# EAGLE design SBM20_counter (EAGLE 9.6.2)
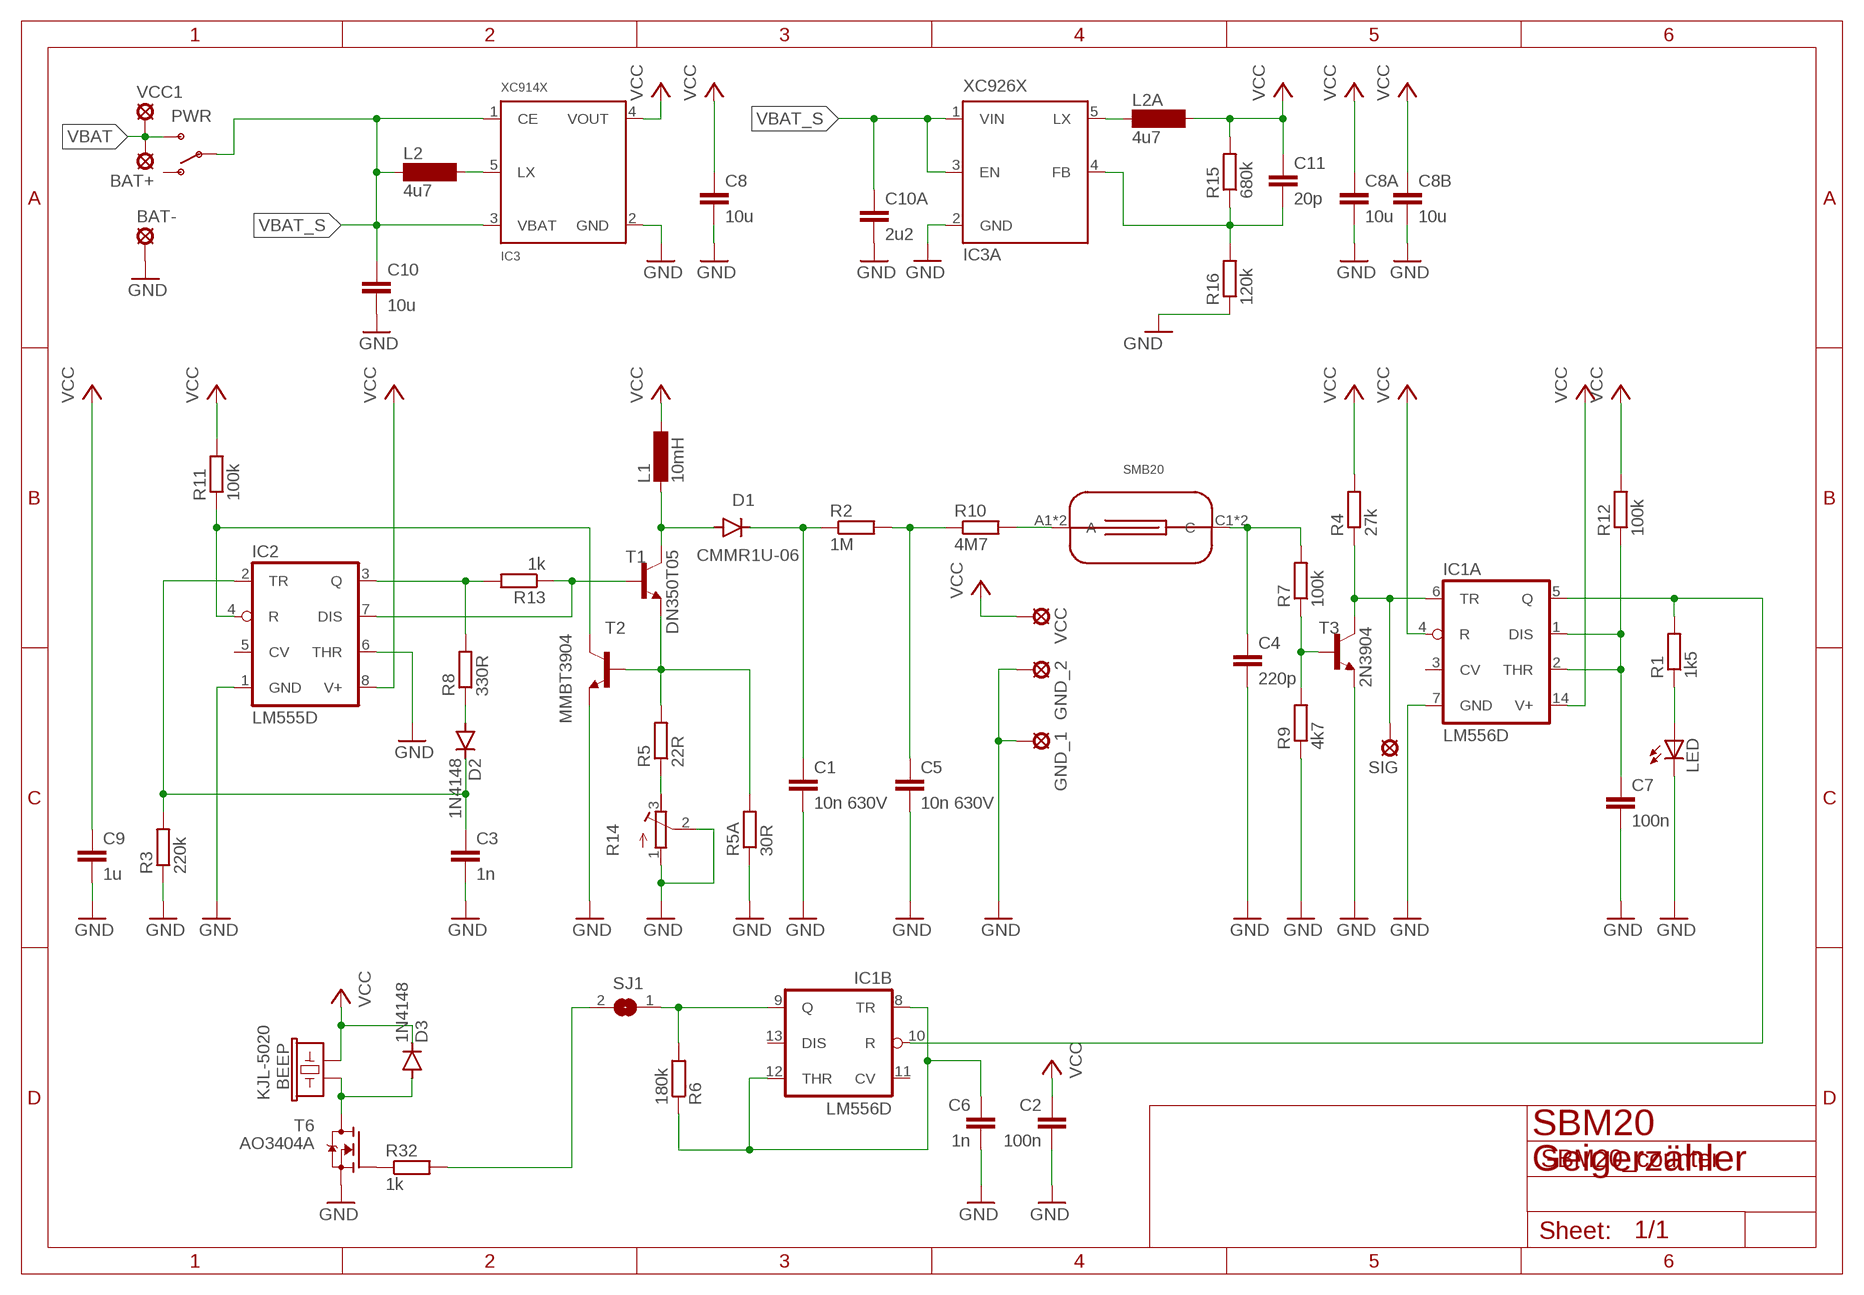
[diagram p0: schematic, sheet 1]

## Parts
BAT+  LSP10_CAST  [CASTEL_1]
BAT-  LSP10_CAST  [CASTEL_1]
BEEP  KJL-5020  BUZZER-5020  [KLJ-5020]
C1  10n 630V  C-EUC1206  [C1206]
C2  100n  C-EUC0603  [C0603]
C3  1n  C-EUC0603  [C0603]
C4  220p  C-EUC0603  [C0603]
C5  10n 630V  C-EUC1206  [C1206]
C6  1n  C-EUC0603  [C0603]
C7  100n  C-EUC0603  [C0603]
C8  10u  C-EUC1206  [C1206]
C8A  10u  C-EUC1206  [C1206]
C8B  10u  C-EUC1206  [C1206]
C9  1u  C-EUC1206  [C1206]
C10  10u  C-EUC1206  [C1206]
C10A  2u2  C-EUC1206  [C1206]
C11  20p  C-EUC0603  [C0603]
D1  CMMR1U-06  DIODE-DO-214AC  [DO-214AC]
D2  1N4148  DIODE-SOD123  [SOD123]
D3  1N4148  DIODE-SOD123  [SOD123]
GND_1  LSP10_CAST  [CASTEL_1]
GND_2  LSP10_CAST  [CASTEL_1]
IC1  LM556D  [SO14]
IC2  LM555D  [SO08]
IC3  XC914X  [SOT23-5]
IC3A  XC926X  [SOT23-5]
L1  10mH  L-EUL8065  [L8065]
L2  4u7  L  [L5050]
L2A  4u7  L  [L5050]
LED  LEDCHIPLED_1206  [CHIPLED_1206]
PWR  SWITCH-SPDT-SMD-A  [SWITCH-SPST-SMD-A]
R1  1k5  R-EU_R0603  [R0603]
R2  1M  R-EU_R1206  [R1206]
R3  220k  R-EU_R0603  [R0603]
R4  27k  R-EU_R0603  [R0603]
R5  22R  R-EU_R0603  [R0603]
R5A  30R  R-EU_R0603  [R0603]
R6  180k  R-EU_R0603  [R0603]
R7  100k  R-EU_R0603  [R0603]
R8  330R  R-EU_R0603  [R0603]
R9  4k7  R-EU_R0603  [R0603]
R10  4M7  R-EU_R1206  [R1206]
R11  100k  R-EU_R0603  [R0603]
R12  100k  R-EU_R0603  [R0603]
R13  1k  R-EU_R0603  [R0603]
R14  R-TRIMM3224J  [RTRIM3224J]
R15  680k  R-EU_R0603  [R0603]
R16  120k  R-EU_R0603  [R0603]
R32  1k  R-EU_R0603  [R0603]
SIG  LSP10_CAST  [CASTEL_1]
SJ1  SJ  [SJ]
T1  DN350T05  MMBT3904LT1-NPN-SOT23-BEC  [SOT23-BEC]
T2  MMBT3904  MMBT3904LT1-NPN-SOT23-BEC  [SOT23-BEC]
T3  2N3904  MMBT3904LT1-NPN-SOT23-BEC  [SOT23-BEC]
T6  AO3404A  N-MOSFET-SOT23-3  [SOT23]
U$1  SMB20  STS5  [STS5]
VCC  LSP10_CAST  [CASTEL_1]
VCC1  LSP10_CAST  [CASTEL_1]

## Nets
GND: BAT-.C(MP) BAT-.V(MP) C1.2 C2.2 C3.2 C4.2 C5.2 C6.2 C7.2 C8.2 C8A.2 C8B.2 C9.2 C10.2 C10A.2 GND_1.C(MP) GND_1.V(MP) GND_2.C(MP) GND_2.V(MP) IC1.7(A:GND) IC2.1(GND) IC2.6(THR) IC3.2(GND) IC3A.2(GND) LED.C R3.1 R5A.1 R9.1 R14.1(A) R14.2(S) R16.1 T2.E T3.E T6.2(S)
N$1: R5.2 R5A.2 T1.E T2.B
N$2: IC2.3(Q) R8.2 R13.2
N$3: C3.1 D2.C IC2.2(TR) R3.2
N$4: IC2.4(R) R11.1 T2.C
N$5: IC2.7(DIS) R13.1 T1.B
N$6: D2.A R8.1
N$7: R5.1 R14.3(E)
N$8: D1.A L1.2 T1.C
N$9: C1.1 D1.C R2.1
N$10: C5.1 R2.2 R10.1
N$11: R10.2 U$1.A1(A) U$1.A2(A)
N$12: C4.1 R7.2 U$1.C1(C) U$1.C2(C)
N$13: R7.1 R9.2 T3.B
N$14: IC1.6(A:TR) R4.1 SIG.C(MP) SIG.V(MP) T3.C
N$15: IC1.5(A:Q) IC1.10(B:R) R1.2
N$16: C7.1 IC1.1(A:DIS) IC1.2(A:THR) R12.1
N$17: IC1.9(B:Q) R6.2 SJ1.1
N$18: LED.A R1.1
N$19: R32.2 SJ1.2
N$20: IC3A.5(LX) L2A.1
N$21: C6.1 IC1.8(B:TR) IC1.12(B:THR) R6.1
N$23: IC3.5(LX) L2.2
N$24: C11.2 IC3A.4(FB) R15.1 R16.2
N$29: R32.1 T6.1(G)
N$30: BEEP.- D3.A T6.3(D)
VBAT: BAT+.C(MP) BAT+.V(MP) PWR.3(S) VCC1.C(MP) VCC1.V(MP)
VBAT_S: C10.1 C10A.1 IC3.1(CE) IC3.3(VBAT) IC3A.1(VIN) IC3A.3(EN) L2.1 PWR.2(P)
VCC: BEEP.+ C2.1 C8.1 C8A.1 C8B.1 C9.1 C11.1 D3.C IC1.4(A:R) IC1.14(A:V+) IC2.8(V+) IC3.4(VOUT) L1.1 L2A.2 R4.2 R11.2 R12.2 R15.2 VCC.C(MP) VCC.V(MP)
Unconnected: IC1.3(A:CV) IC1.11(B:CV) IC1.13(B:DIS) IC2.5(CV) PWR.1(O)

## Notes on the sheet
- SBM20
- Geigerzähler

## Library data of the parts
BAT+ BAT- GND_1 GND_2 SIG VCC VCC1 = solpad:LSP10: SOLDER PAD drill 1.0 mm, distributor Buerklin, 12H555
BEEP = SparkFun-Electromechanical:BUZZER: Buzzer Small round buzzers that operate around the audible 2kHz range. You can use these as speakers to create simple music or user interfaces. Variant Overview: PTH - Mini Speaker - PC Mount 12mm 2.048kHz <https://www.sparkfun.com/products/7950> PTH_KIT - Mini Speaker - PC Mount 12mm 2.048kHz <https://www.sparkfun.com/products/7950> KIT simplifies soldering by adding stop mask to one side of the pads. PTH_NO_SILK - Mini Speaker - PC Mount 12mm 2.048kHz <https://www.sparkfun.com/products/7950> No silkscreen indicator of buzzer outline. PTH_KIT_NO_SILK - Mini Speaker - PC Mount 12mm 2.048kHz <https://www.sparkfun.com/products/7950> KIT package w/o silkscreen SMD - Buzzer Audio Magnetic (CCV-084B16) SMD buzzer used on, e.g. the LilyPad Buzzer <https://www.sparkfun.com/products/8463> and RFID USB Reader <https://www.sparkfun.com/products/9963>. SMD_KIT - Buzzer Audio Magnetic (CCV-084B16) SMD Buzzer with elongated pins to make soldering easier. Used on the SparkFun Simon Says - Surface Mount Soldering Kit <https://www.sparkfun.com/products/10935>.; LCSC: C556937
C1-C8 C8A C8B C9 C10 C10A C11 = rcl:C-EU: CAPACITOR, European symbol; SPICEPREFIX: C
D1-D3 = diode:DIODE-: DIODE
IC1 = linear:*556: Dual TIMER
IC2 = linear:*555: TIMER
IC3 = torex:XC914X: Step-Up Converter; DIGIKEY: 893-1373-1-ND
IC3A = torex:XC926X: Step-Down Converter; DIGIKEY: 893-1330-1-ND
L1 = rcl:L-EU: INDUCTOR, European symbol
L2 L2A = misc:L; DIGIKEY: 490-7779-1-ND
LED = led:LED: LED OSRAM: - CHIPLED LG R971, LG N971, LY N971, LG Q971, LY Q971, LO R971, LY R971 LH N974, LH R974 LS Q976, LO Q976, LY Q976 LO Q996 - Hyper CHIPLED LW Q18S LB Q993, LB Q99A, LB R99A - SideLED LS A670, LO A670, LY A670, LG A670, LP A670 LB A673, LV A673, LT A673, LW A673 LH A674 LY A675 LS A676, LA A676, LO A676, LY A676, LW A676 LS A679, LY A679, LG A679 - Hyper Micro SIDELED® LS Y876, LA Y876, LO Y876, LY Y876 LT Y87S - SmartLED LW L88C, LW L88S LB L89C, LB L89S, LG L890 LS L89K, LO L89K, LY L89K LS L896, LA L896, LO L896, LY L896 - TOPLED LS T670, LO T670, LY T670, LG T670, LP T670 LSG T670, LSP T670, LSY T670, LOP T670, LYG T670 LG T671, LOG T671, LSG T671 LB T673, LV T673, LT T673, LW T673 LH T674 LS T676, LA T676, LO T676, LY T676, LB T676, LH T676, LSB T676, LW T676 LB T67C, LV T67C, LT T67C, LS T67K, LO T67K, LY T67K, LW E67C LS E67B, LA E67B, LO E67B, LY E67B, LB E67C, LV E67C, LT E67C LW T67C LS T679, LY T679, LG T679 LS T770, LO T770, LY T770, LG T770, LP T770 LB T773, LV T773, LT T773, LW T773 LH T774 LS E675, LA E675, LY E675, LS T675 LS T776, LA T776, LO T776, LY T776, LB T776 LHGB T686 LT T68C, LB T68C - Hyper Mini TOPLED® LB M676 - Mini TOPLED Santana® LG M470 LS M47K, LO M47K, LY M47K Source: http://www.osram.convergy.de LUXEON: - LUMILED® LXK2-PW12-R00, LXK2-PW12-S00, LXK2-PW14-U00, LXK2-PW14-V00 LXK2-PM12-R00, LXK2-PM12-S00, LXK2-PM14-U00 LXK2-PE12-Q00, LXK2-PE12-R00, LXK2-PE12-S00, LXK2-PE14-T00, LXK2-PE14-U00 LXK2-PB12-K00, LXK2-PB12-L00, LXK2-PB12-M00, LXK2-PB14-N00, LXK2-PB14-P00, LXK2-PB14-Q00 LXK2-PR12-L00, LXK2-PR12-M00, LXK2-PR14-Q00, LXK2-PR14-R00 LXK2-PD12-Q00, LXK2-PD12-R00, LXK2-PD12-S00 LXK2-PH12-R00, LXK2-PH12-S00 LXK2-PL12-P00, LXK2-PL12-Q00, LXK2-PL12-R00 Source: www.luxeon.com KINGBRIGHT: KA-3528ASYC Source: www.kingbright.com
PWR = SparkFun-Electromechanical:SWITCH-SPDT: SPDT Switch Simple slide switch, Spark Fun Electronics SKU : COM-00102 DPDT SMT slide switch, AYZ0202, SWCH-08179; LCSC: C319019; PROD_ID: SWCH-10651
R1-R5 R5A R6-R13 R15 R16 = rcl:R-EU_: RESISTOR, European symbol; SPICEPREFIX: R
R14 = rcl:R-TRIMM: Trimm resistor; SPICEMODEL: X; SPICEPREFIXL: POT
R32 = rcl:R-EU_: RESISTOR, European symbol; LCSC: C11702; SPICEPREFIX: R
SJ1 = jumper:SJ: SMD solder JUMPER
T1-T3 = transistor:*-NPN-: NPN Transistror BF959 corrected 2008.03.06
T6 = transistor-fet:N-MOSFET: N-MOSFET; LCSC: C30010
U$1 = SBT10A:STS5: STS5

## Board
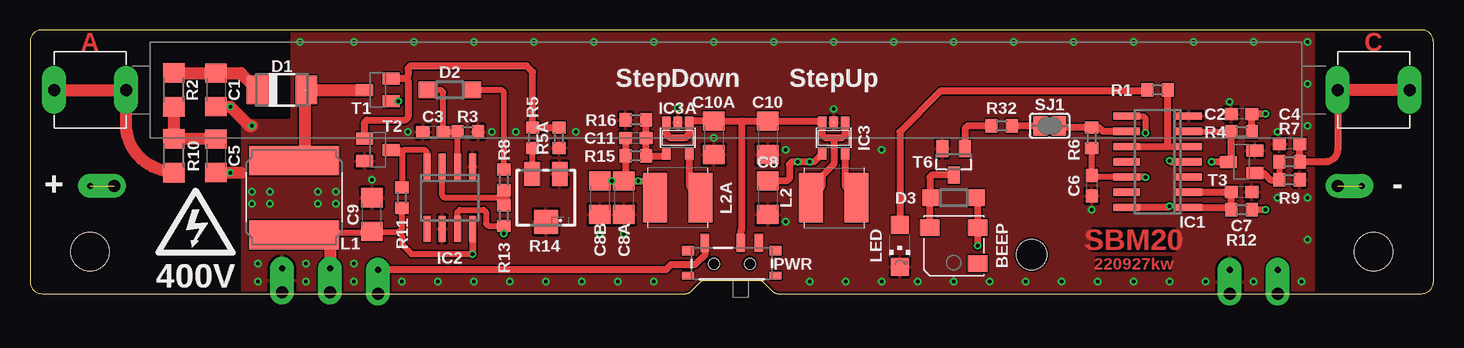
[diagram p1: board, top side]
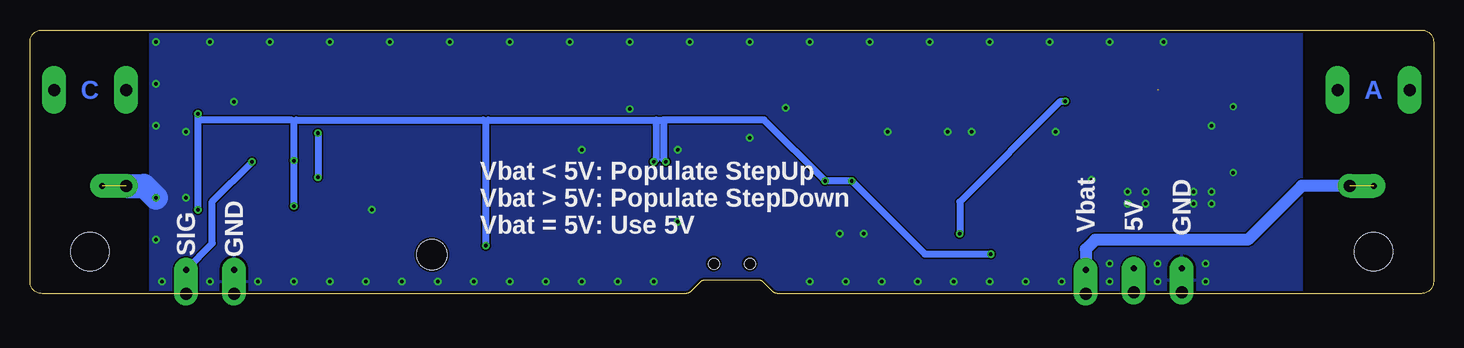
[diagram p2: board, bottom side, seen from below]

Size 117 x 22 mm. Coordinates in mm from the lower left corner, seen from the top.
Outline: 0,21 0,1 arc90 1,0 54.69,0 arc45 55.05,0.15 55.85,0.95 arc-45 56.21,1.1 60.79,1.1 arc-45 61.15,0.95 61.95,0.15 arc45 62.31,0 116,0 arc90 117,1 117,21 arc90 116,22 1,22 arc90 0,21
Copper layers (1*16): Top 0.035mm / dielectric 1.5mm / Bottom 0.035mm
Design rules "JLCPCB_2Layer_1oz": minimum track width 5mil, minimum drill 0.3mm, track to track 5mil, track to pad 5mil, pad to pad 5mil, via to via 5mil, smd to smd 0mil, copper to edge 0.2mm, drill to drill 0.5mm, minimum pad ring 0.2mm, minimum via ring 0.15mm, stop-mask expansion 0.05mm, vias tented up to drill 0.3mm, thermal gap 0.2mm
Holes 3.2 mm at 112,3.5 5,3.5
Holes 2.5 mm at 83.5,3.25

### Footprints (pad centres in the part's own frame; a part is rotated, then mirrored left to right if it is on the bottom)
CASTEL_1 = drill 1 pad 2 offset: C 0,0 | drill 0.5: V 2,0
KLJ-5020 = smd 1.6 x 1.4: + -2,-1.5; - 2,-1.5; S -2,1.5
C1206 = smd 1.6 x 1.8: 1 -1.4,0; 2 1.4,0
C0603 = smd 1.1 x 1: 1 -0.85,0; 2 0.85,0
DO-214AC = smd 1.8 x 2.4: A 2.025,0; C -2.025,0
SOD123 = smd 1.4 x 1.4: A 1.9,0; C -1.9,0
SO14 = smd 0.6 x 2.2: 1 -3.81,-2.6; 2 -2.54,-2.6; 3 -1.27,-2.6; 4 0,-2.6; 5 1.27,-2.6; 6 2.54,-2.6; 7 3.81,-2.6; 8 3.81,2.6; 9 2.54,2.6; 10 1.27,2.6; 11 0,2.6; 12 -1.27,2.6; 13 -2.54,2.6; 14 -3.81,2.6
SO08 = smd 0.6 x 2.2: 1 -1.905,-2.6; 2 -0.635,-2.6; 3 0.635,-2.6; 4 1.905,-2.6; 5 1.905,2.6; 6 0.635,2.6; 7 -0.635,2.6; 8 -1.905,2.6
SOT23-5 = smd 0.69 x 0.99: 1 -0.95,-1.29; 2 0,-1.29; 3 0.95,-1.29; 4 0.95,1.3; 5 -0.95,1.3
L8065 = smd 2.4 x 7.5: 1 3.1,0; 2 -3.1,0
L5050 = smd 2 x 4.1: 1 -1.9,0; 2 1.9,0
CHIPLED_1206 = smd 1.5 x 1.5: A 0,-1.75; C 0,1.75
SWITCH-SPST-SMD-A = smd 0.7 x 1.5: 1 -2.25,-1.75; 2 -0.75,-1.75; 3 2.25,-1.75 | smd 1 x 0.6: GND1 -3.65,1; GND3 3.65,1 | smd 1 x 0.8: GND2 -3.65,-1.1; GND4 3.65,-1.1 | hole 0.9: -1.5,0; 1.5,0
R0603 = smd 1 x 1.1: 1 -0.85,0; 2 0.85,0
R1206 = smd 1.6 x 1.803: 1 -1.422,0; 2 1.422,0
RTRIM3224J = smd 1.3 x 2: 1 -1.15,-2; 3 1.15,-2 | smd 2 x 2: 2 0,2
SJ = smd 1.168 x 1.6: 1 -0.762,0; 2 0.762,0
SOT23-BEC = smd 1 x 1.4: B -0.95,-1.1; C 0,1.1; E 0.95,-1.1
SOT23 = smd 1 x 1.4: 1 -0.95,-1.1; 2 0.95,-1.1; 3 0,1.1
STS5 = drill 1 pad 2 long: A1 -3,0; A2 3,0; C1 104,0; C2 110,0

### Placement (x,y rotation side)
BAT+  7,9 180 top
BAT-  109,9 0 top
BEEP  77,4 180 top
C1  15.5,17 270 top
C2  101,15 180 top
C3  33.6,13.5 180 top
C4  105,12.5 180 top
C5  15.5,11.5 270 top
C6  88.5,9 270 top
C7  101,8.5 0 top
C8  61.5,8 270 top
C8A  49.5,8 270 top
C8B  47.5,8 270 top
C9  28.5,6.6 90 top
C10  61.5,13 270 top
C10A  57,13 270 top
C11  50.5,13 0 top
D1  21,17 0 top
D2  35,17 0 top
D3  77,8 180 top
GND_1  21,0.1 90 top
GND_2  100,0 90 top
IC1  94,11 90 top
IC2  35,8 180 top
IC3  67,13 180 top
IC3A  54,13 180 top
L1  22,8 270 top
L2  67,8 0 top
L2A  54,8 180 top
LED  72.5,4 180 top
PWR  58.5,2.5 180 top
R1  94,17 0 top
R2  12,17 270 top
R3  36.5,13.5 180 top
R4  101,13.5 0 top
R5  41.9,13 90 top
R5A  44.1,13 90 top
R6  88.5,13 90 top
R7  105,11 0 top
R8  39.5,9.5 270 top
R9  105,9.5 180 top
R10  12,11.5 270 top
R11  31,8 270 top
R12  101,7 0 top
R13  39.5,6.5 90 top
R14  43,8 180 top
R15  50.5,11.5 180 top
R16  50.5,14.5 0 top
R32  81,14 0 top
SIG  104,0 90 top
SJ1  85,14 180 top
T1  29,17 90 top
T2  29,12 270 top
T3  101,11 90 top
T6  77,11 180 top
U$1  5,17 0 top
U$2  [HIGHVOLTAGE]  13.8,6 0 top
VCC  25,0.1 90 top
VCC1  29,0 90 top

### Tracks (layer width: path | path; a pad name or v marks a point on that pad's centre or on a via)
GND  (via drill 0.3)  (1 unrouted)
  Top 1: C1.2 v16.7,15.6 18.3,14 v18.5,14 | C5.2 v16.7,10.1 17.6,10.1
  Bottom 2: BAT-.C 107.5,9 v106.5,8
  other vias: 102,21 97,21 23,1 22.5,21 32,21 47,21 38.5,13.5 31.5,13.5 19,1 45.5,13.5 40.5,13.5 98,1 27,1 31,1 34,1 37,1 40,1 43,1 106,1 86,1 87,21 92,21 106.5,14 88.5,7 100,16 104,8 106.5,21 106.5,17.5 106.5,4.5 102,1 18.5,7.5 18.5,8.5 25.5,7.5 95,1 92,1 89,1 25.5,8.5 28.5,9.5 46,1 49,1 52,1 83,1 80,1 77,1 74,1 71,1 68,1 65,1 82,21 77,21 72,21 67,21 62,21 57,21 52,21 42,21 37,21 27,21 57,13 63,12 71,12 47.5,5 49.5,5 54,15.5 67,15.4 19,2.5 23,2.5 20,8.5 20,7.5 24,8.5 24,7.5 104,13.5 27,2.5 63,6
  pour Bottom: 11,0 107,0 107,22 11,22
  pour Top: 17.7,0 107,0 107,22 21.8,22 21.8,14.7 21.6,14.5 17.9,14.5 17.7,14.3
N$1
  Top 0.6: T2.B 27.9,14.3 28.1,14.5 31.3,14.5 31.5,14.7 31.5,17.75 31.3,17.95 | 31.3,17.95 T1.E | 31.3,17.95 31.5,18.15 31.5,18.8 31.7,19 41.4,19 41.9,18.5 R5.2 R5A.2
N$2
  Top 0.5: 39.35,7.5 R13.2 | 39.5,8 34.56,8 34.37,8.2 IC2.3
  Top 1: R8.2 39.5,8 R13.2
N$3
  Top 0.5: IC2.2 35.63,13.48 R3.2 C3.1 34.45,16.8 34.25,17 D2.C
N$4
  Top 0.5: T2.C 30.8,12 31,11.8 | 31,11.8 R11.1 | IC2.4 33.09,11.8 32.9,12 31.2,12 31,11.8
N$5  (via drill 0.3)
  Top 0.5: IC2.7 35.63,6.8 35.84,7 37.8,7 38,6.8 38,5.85 38.2,5.65 R13.1 | v30.7,16.05 T1.B
  Top 0.6: v39.5,5 R13.1
  Bottom 0.5: 39.5,5.1 v39.5,5
  Bottom 0.6: v39.5,5 39.5,7.65 31.1,16.05 v30.7,16.05
N$6
  Top 0.5: R8.1 39.5,16.8 39.3,17 D2.A
N$7
  Top 0.5: R5.1 41.85,12.1 R14.3
N$8  (1 unrouted)
  Top 1: 22.9,17 22.9,11.1 L1.2 | D1.A T1.C
N$9
  Top 1: R2.1 12,18.4 C1.1 | 15.5,18.5 C1.1 | C1.1 17.57,18.4 D1.C
N$10
  Top 1: 15.5,12.87 C5.1 15.48,12.92 R10.1 R2.2
N$11
  Top 1: U$1.A1 U$1.A2 8,14.18 arc90 12,10.18 R10.2
N$12
  Top 0.6: U$1.C1 109,12 arc-90 108,11 R7.2 C4.1
  Top 1: U$1.C2 U$1.C1
N$13
  Top 0.3: 101.8,10.05 T3.B
  Top 0.5: R7.1 R9.2
  Top 0.6: T3.B 102.85,10.05 103.4,9.5 R9.2
N$14  (via drill 0.3)
  Top 0.5: T3.C 100.15,11.25 | IC1.6 100.11,13.54 R4.1
  Top 0.6: 100.15,11.25 R4.1 | T3.C v98.5,11
  Bottom 0.5: SIG.C SIG.V
  Bottom 0.6: SIG.V 101.8,4.2 101.8,7.7 v98.5,11
N$15
  Top 0.6: IC1.10 94,12.27 94.85,12.27 | 94.85,12.27 IC1.5 | 94.85,12.27 R1.2
N$16
  Top 0.5: C7.1 100.11,8.46 100.15,8.42 | R12.1 100.15,7.1 100.06,7.19
  Top 0.6: IC1.2 100.11,8.46 | 100.15,7.1 100.15,8.42 | IC1.1 100.06,7.19
N$17
  Top 0.5: 85.91,13.85 SJ1.1
  Top 0.6: IC1.9 89.46,13.54 89.15,13.85 R6.2 85.91,13.85
N$18
  Top 0.5: R1.1 93.05,16.9
  Top 0.6: 93.05,16.9 75.9,16.9 72.5,13.5 LED.A
N$19
  Top 0.6: SJ1.2 R32.2
N$20
  Top 0.6: IC3A.5 54.95,8.95 L2A.1
N$21  (via drill 0.3)
  Top 0.5: IC1.12 88.62,9.73 C6.1 R6.1 | v93,13.4 93,14.61 92.8,14.81 IC1.8
  Top 0.6: v93,9.7 92.97,9.73 IC1.12
  Bottom 0.6: v93,13.4 v93,9.7
N$23
  Top 0.6: 68.3,8.6 L2.2 67.95,8.95 IC3.5
N$24
  Top 0.6: R16.2 C11.2 R15.1 52.85,11.5 IC3A.4
N$29
  Top 0.6: R32.1 78.15,14 77.95,13.8 T6.1
N$30
  Top 0.5: 75,8 D3.A
  Top 0.6: BEEP.- 75,8 75,9.7 75.2,9.9 T6.3
VBAT  (1 unrouted)
  Top 0.6: VCC1.C 29,1.4 29.6,2 53,2 53.4,2.4 55.4,2.4 56.25,3.25 PWR.3
  Bottom 1: BAT+.C 11,9 15.5,4.5 28.2,4.5 29,3.7 VCC1.V VCC1.C
VBAT_S
  Top 0.6: IC3.1 67.95,13.25 67.7,13 67,13 | 67,13 66.3,13 66.05,13.25 IC3.3 65.94,14.4 C10.1 59.35,14.4 | 59.35,14.4 C10A.1 55.06,14.4 IC3A.1 54.95,13.3 54.65,13 53.35,13 53.05,13.3 IC3A.3 | 59.35,14.4 59.35,5.35 59.25,5.25 PWR.2 | 67,13 67,10.8 66,9.8 66,8.9 L2.1
VCC  (via drill 0.3)
  Top 0.5: 94.9,7.2 94.81,7.2 94.8,7.19 | 79,8 D3.C | 28.5,5.1 C9.1 | 24.1,5.1 28.5,5.1 | 30.7,5.1 28.5,5.1 | 30.7,5.1 31,5.4 R11.2 | 30.7,5.1 31,4.8 31,4.1 31.8,3.3 v36.9,3.3
  Top 0.6: IC2.8 v36.91,3.31 v36.9,3.3 | R4.2 C2.1 v103,15 | v95,7.3 94.9,7.2 | 94.8,7.19 IC1.14 | v95,11.1 95.1,11 IC1.4 | v103,7 R12.2 | 79,8 BEEP.+ v79,4 | C11.1 R15.2 49.65,9.55 C8A.1 | C8A.1 v50.7,9.4 52.1,9.4 L2A.2 | C8A.1 v48.5,9.4 C8B.1 | IC3.4 65.35,11 v65,11 v64,11 63.5,11 63.3,10.8 63.3,9.6 63.1,9.4 C8.1
  Top 1: VCC.C 25,4.7 24.8,4.9 L1.1 24.1,4.9 24.1,5.1
  Bottom 0.5: VCC.C VCC.V
  Bottom 0.6: v79,4 79,14.3 | 79,14.3 78.8,14.5 64.8,14.5 | 64.8,14.5 64.2,14.5 | v36.9,3.3 42.4,3.3 v48.5,9.4 v50.7,9.4 55.8,14.5 64.2,14.5 | v95,7.3 v95,11.1 95,14.3 | v103,7 103,14.5 | 103,14.5 v103,15 | 79,14.3 79.2,14.5 94.8,14.5 95,14.3 | 95,14.3 95.2,14.5 103,14.5 | 64.2,14.5 64.2,11.2 v64,11 | v65,11 64.8,11.2 64.8,14.5

### Text on the board
Top: A | C | SBM20 | 220927kw
Bottom: A | C
tPlace: StepDown | StepUp | + | - | 400V
bPlace: Vbat < 5V: Populate StepUp / Vbat > 5V: Populate StepDown / Vbat = 5V: Use 5V | GND | Vbat | 5V | GND | SIG